# EasyEDA schematic EC01_esquematico_easyeda.json

## Sheets
1 01 Alimentacao e bateria
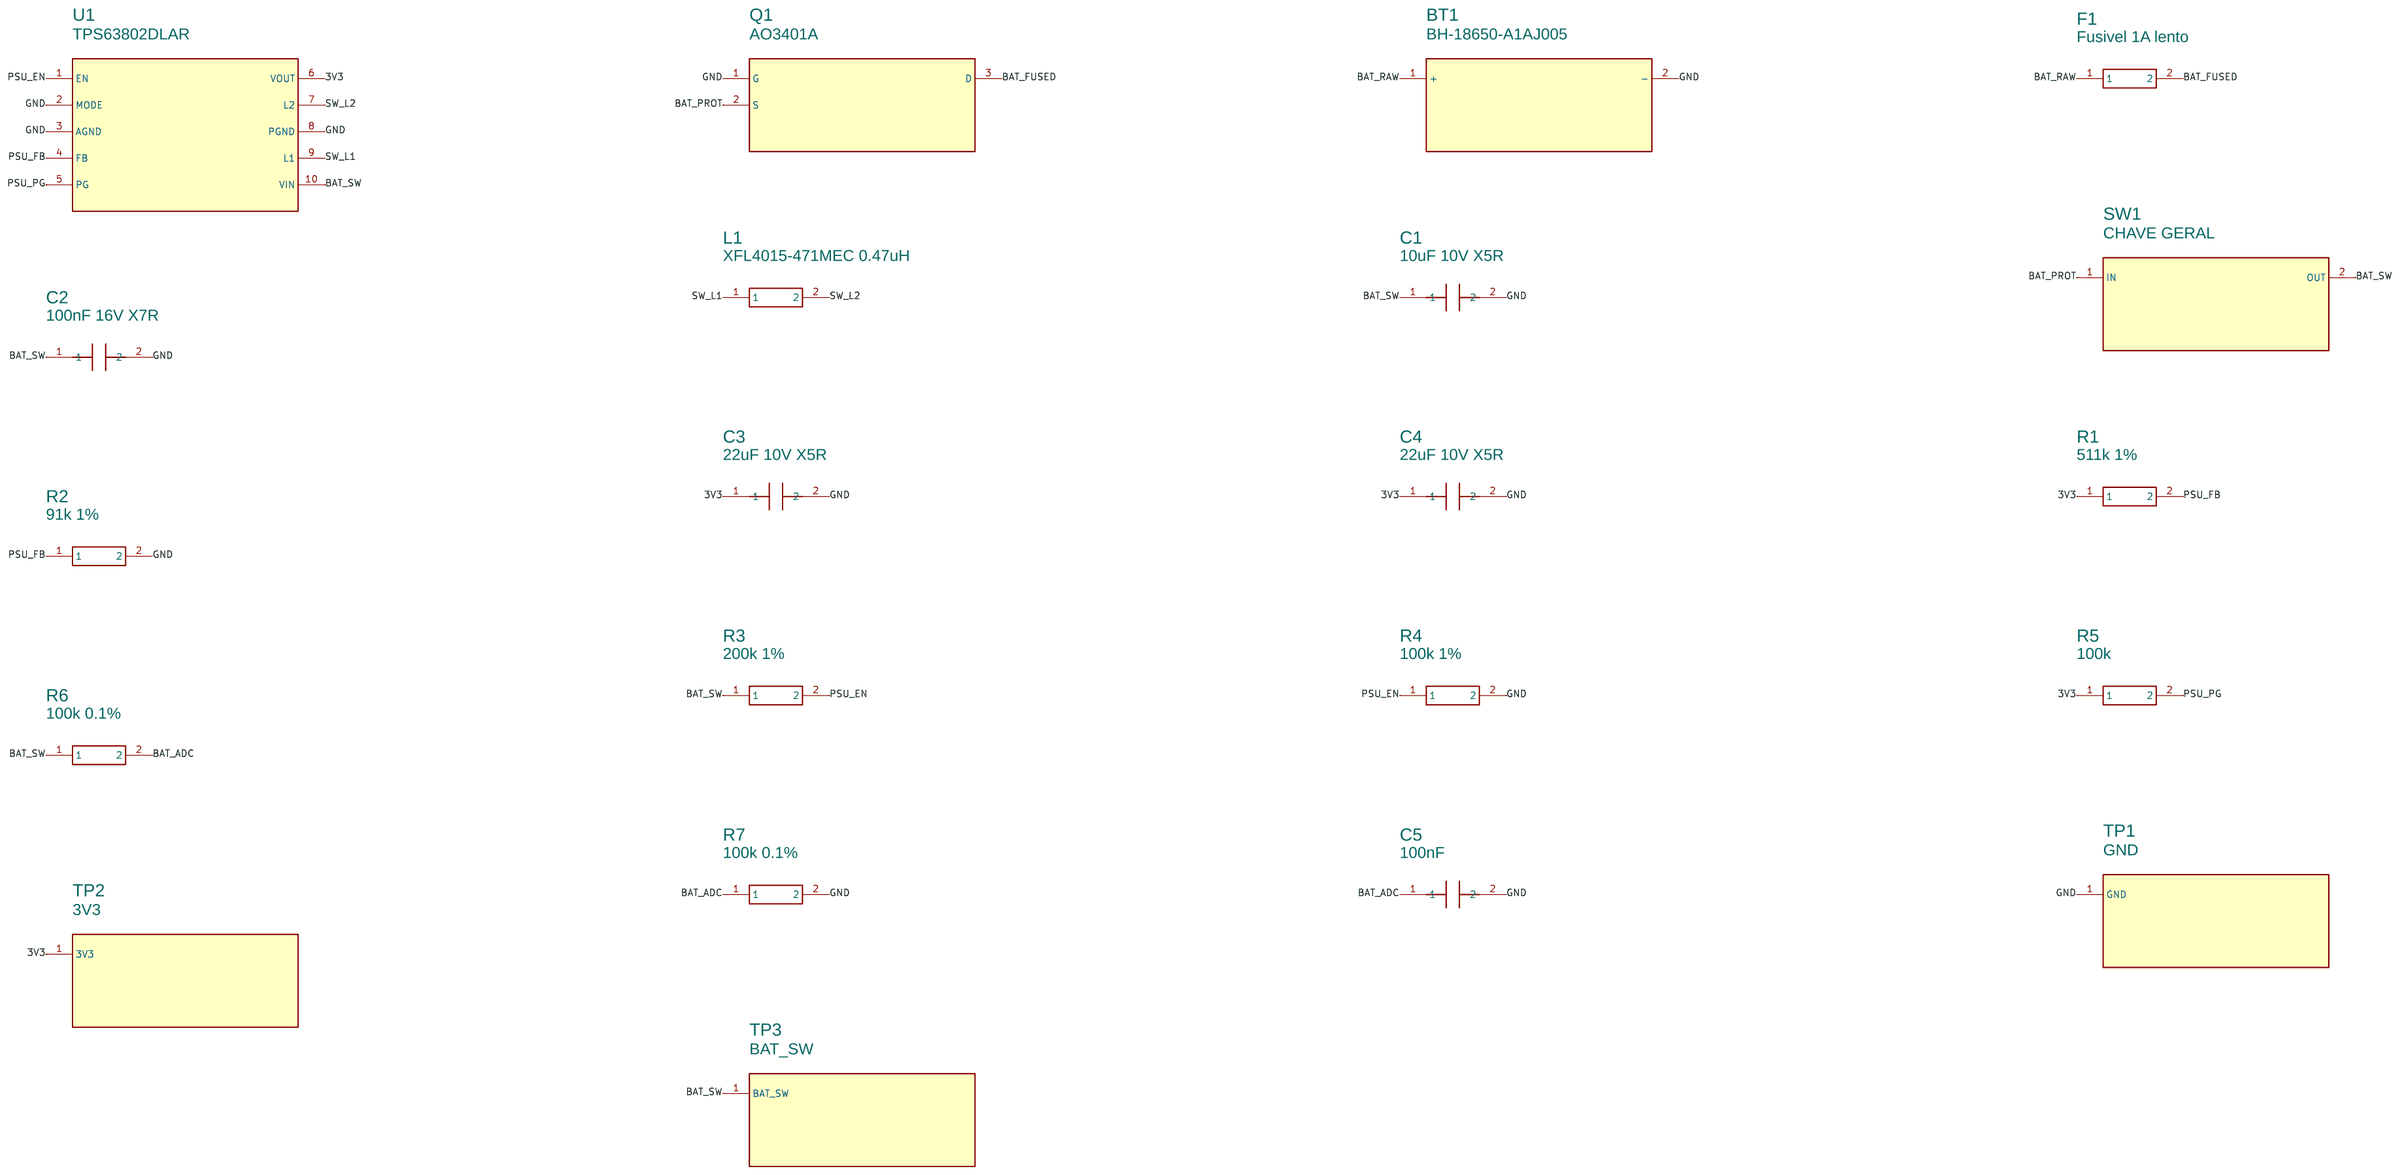
[diagram p0: 01 Alimentacao e bateria]
2 02 ESP32 e inicializacao
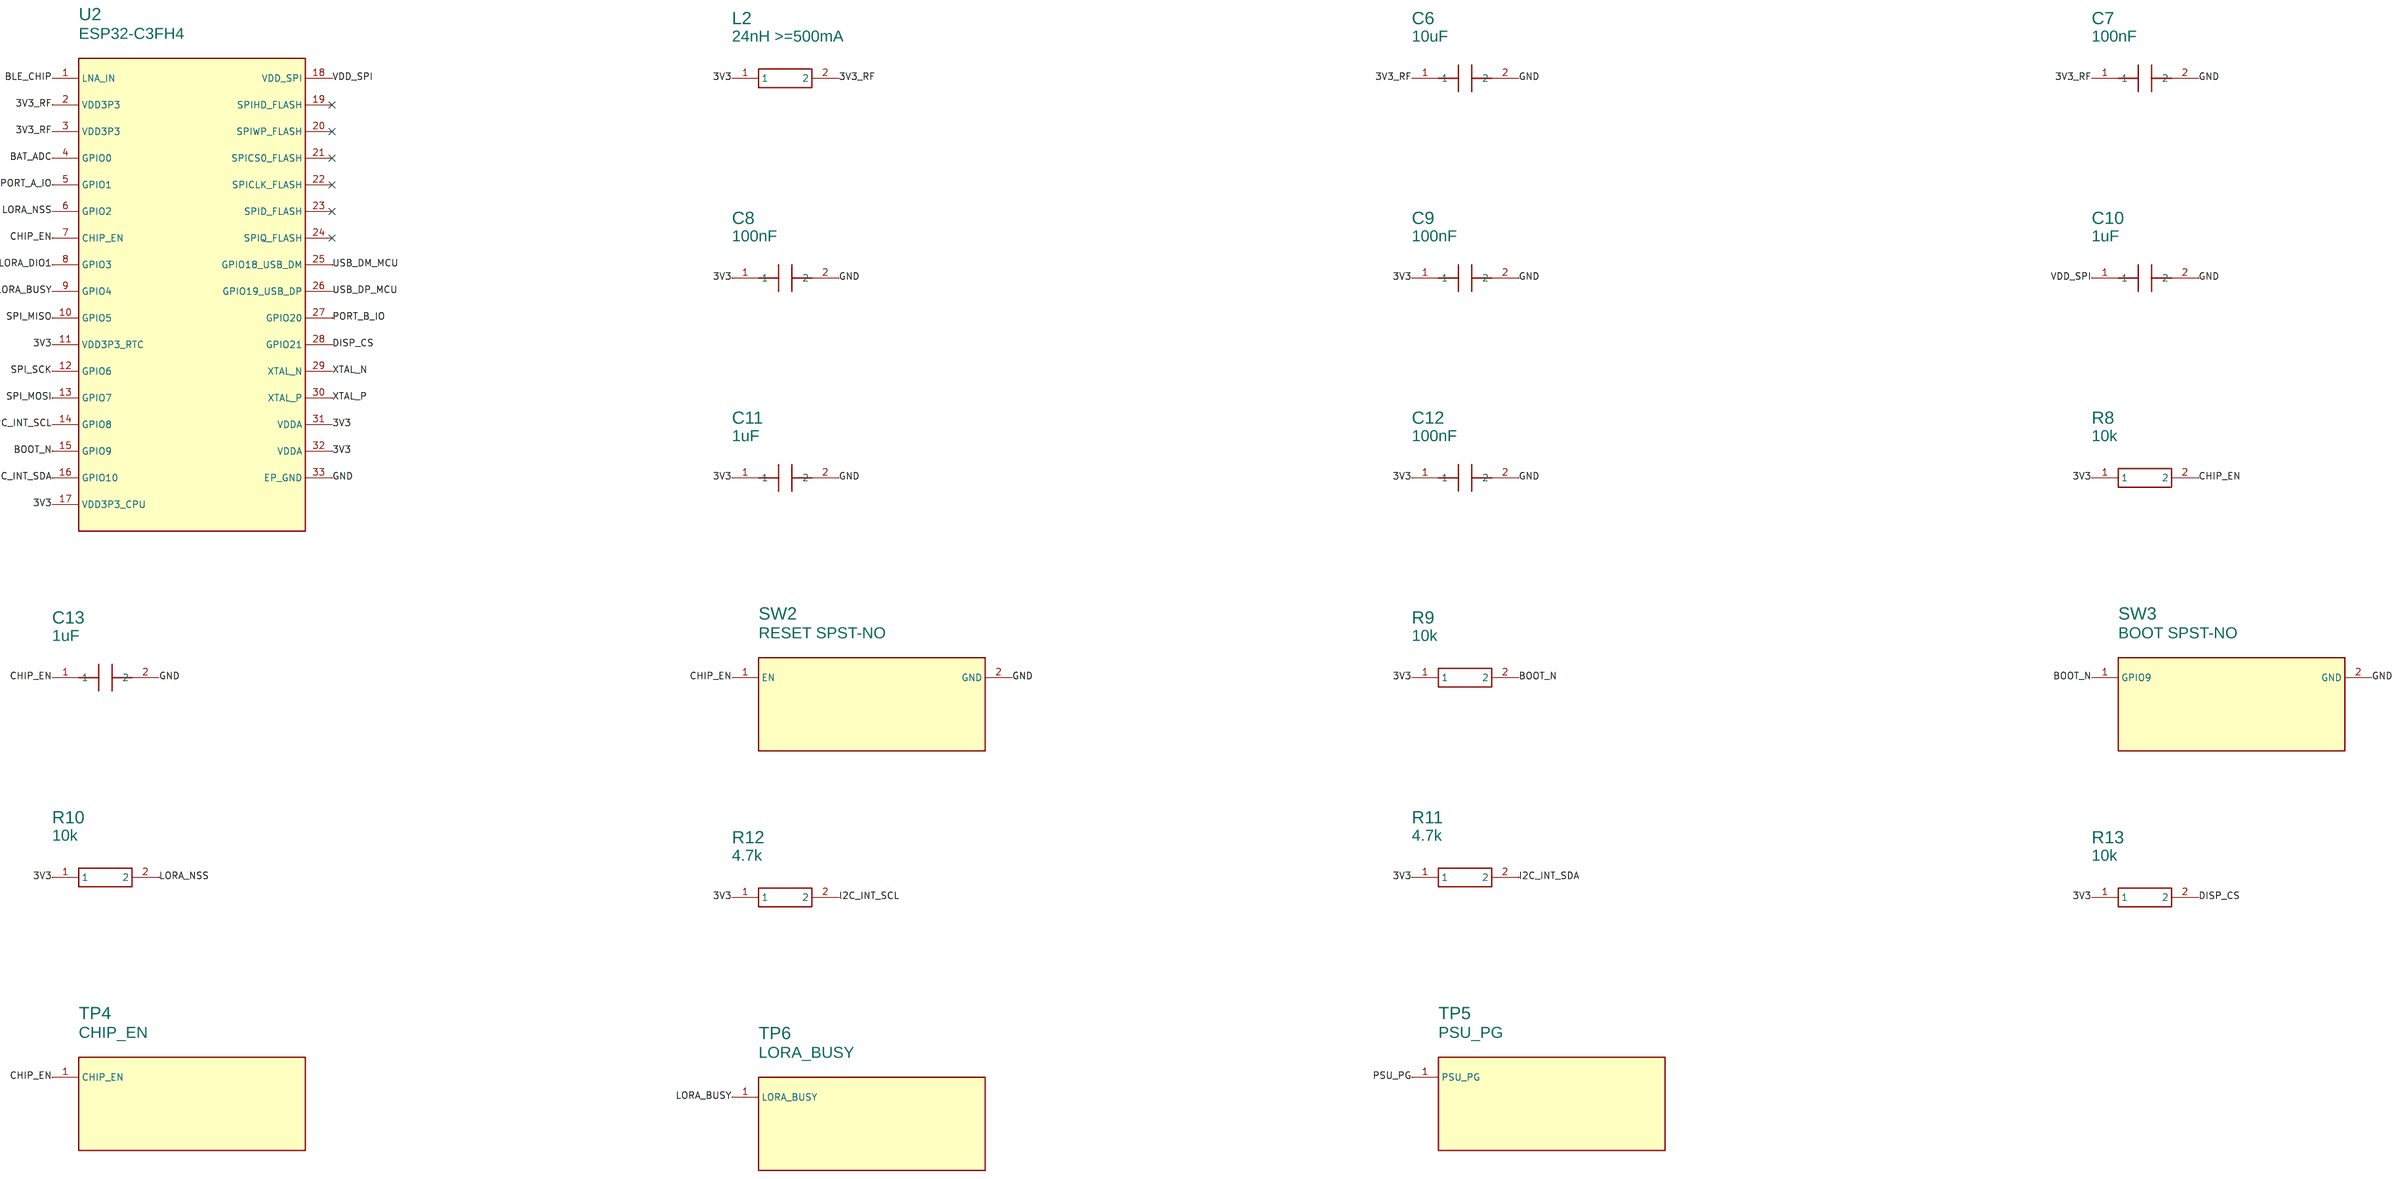
[diagram p1: 02 ESP32 e inicializacao]
3 03 BLE e cristal
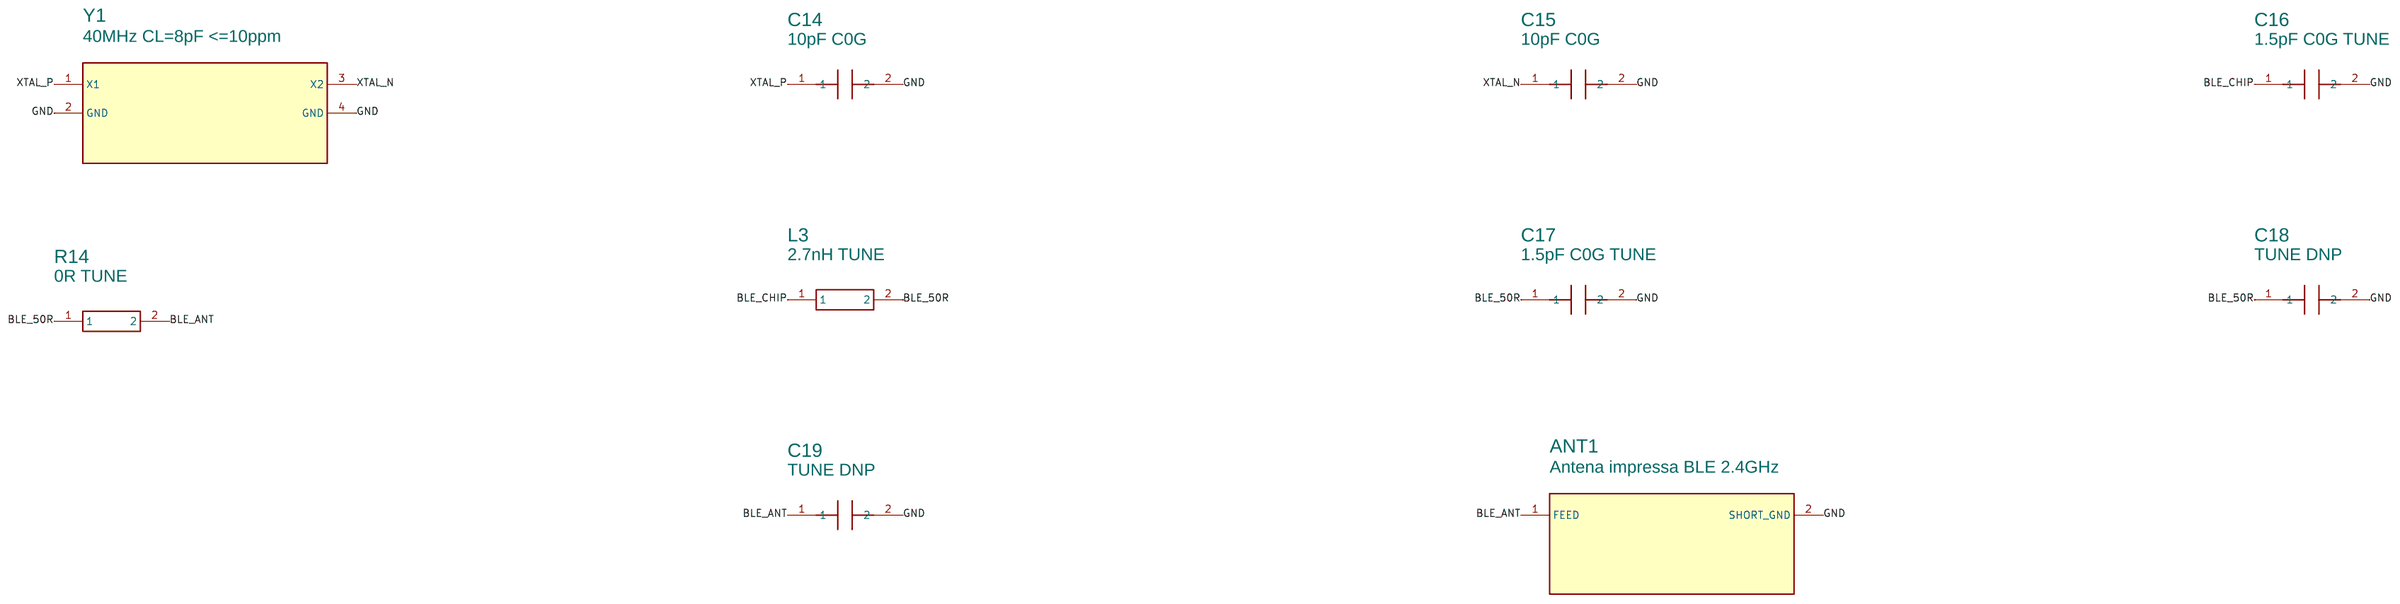
[diagram p2: 03 BLE e cristal]
4 04 Radio LoRa
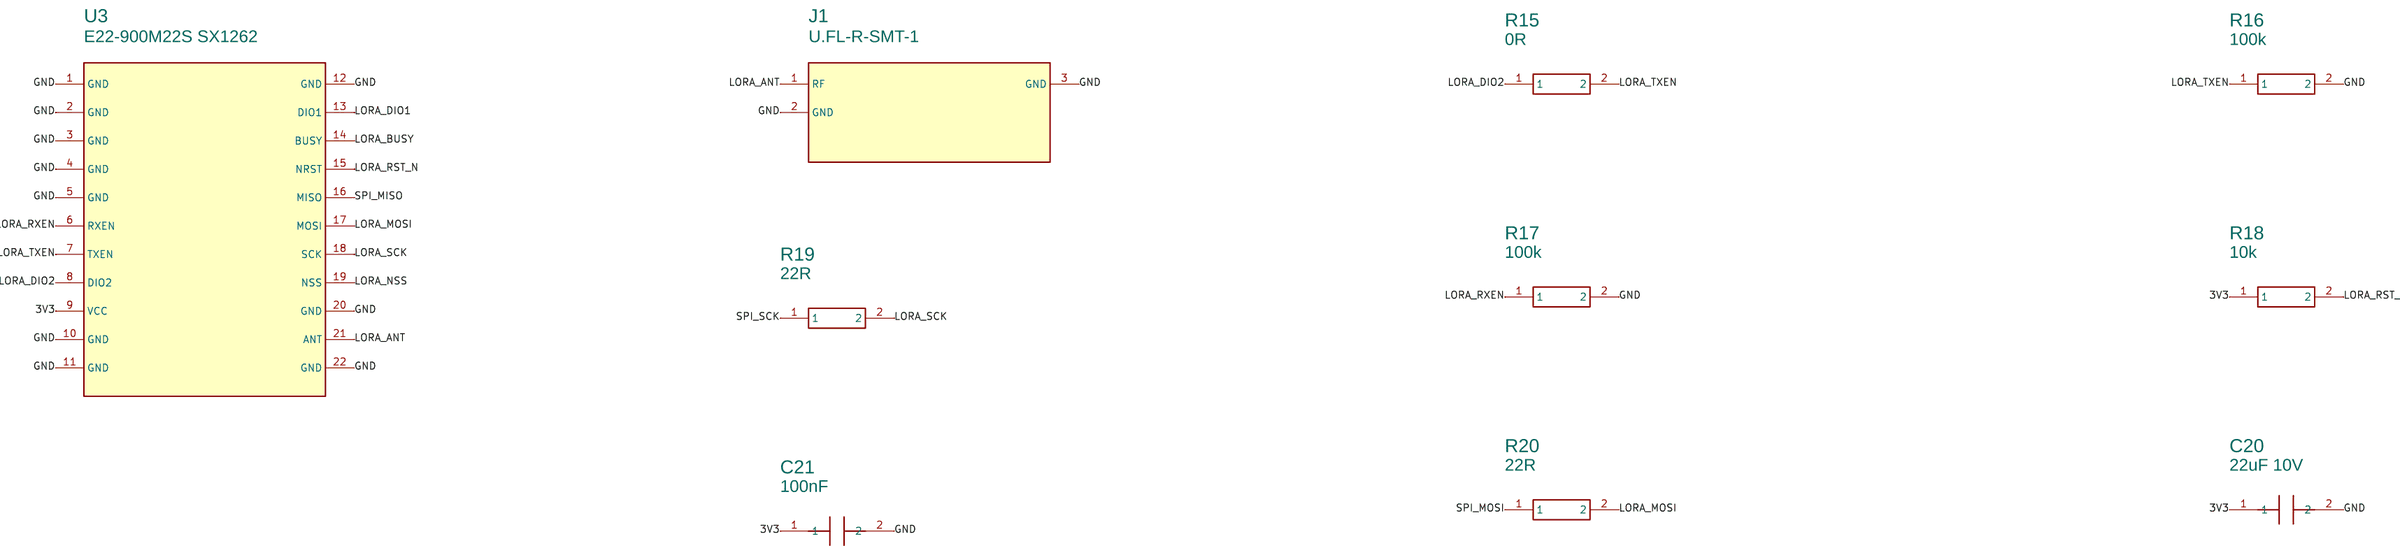
[diagram p3: 04 Radio LoRa]
5 05 Expansao e display
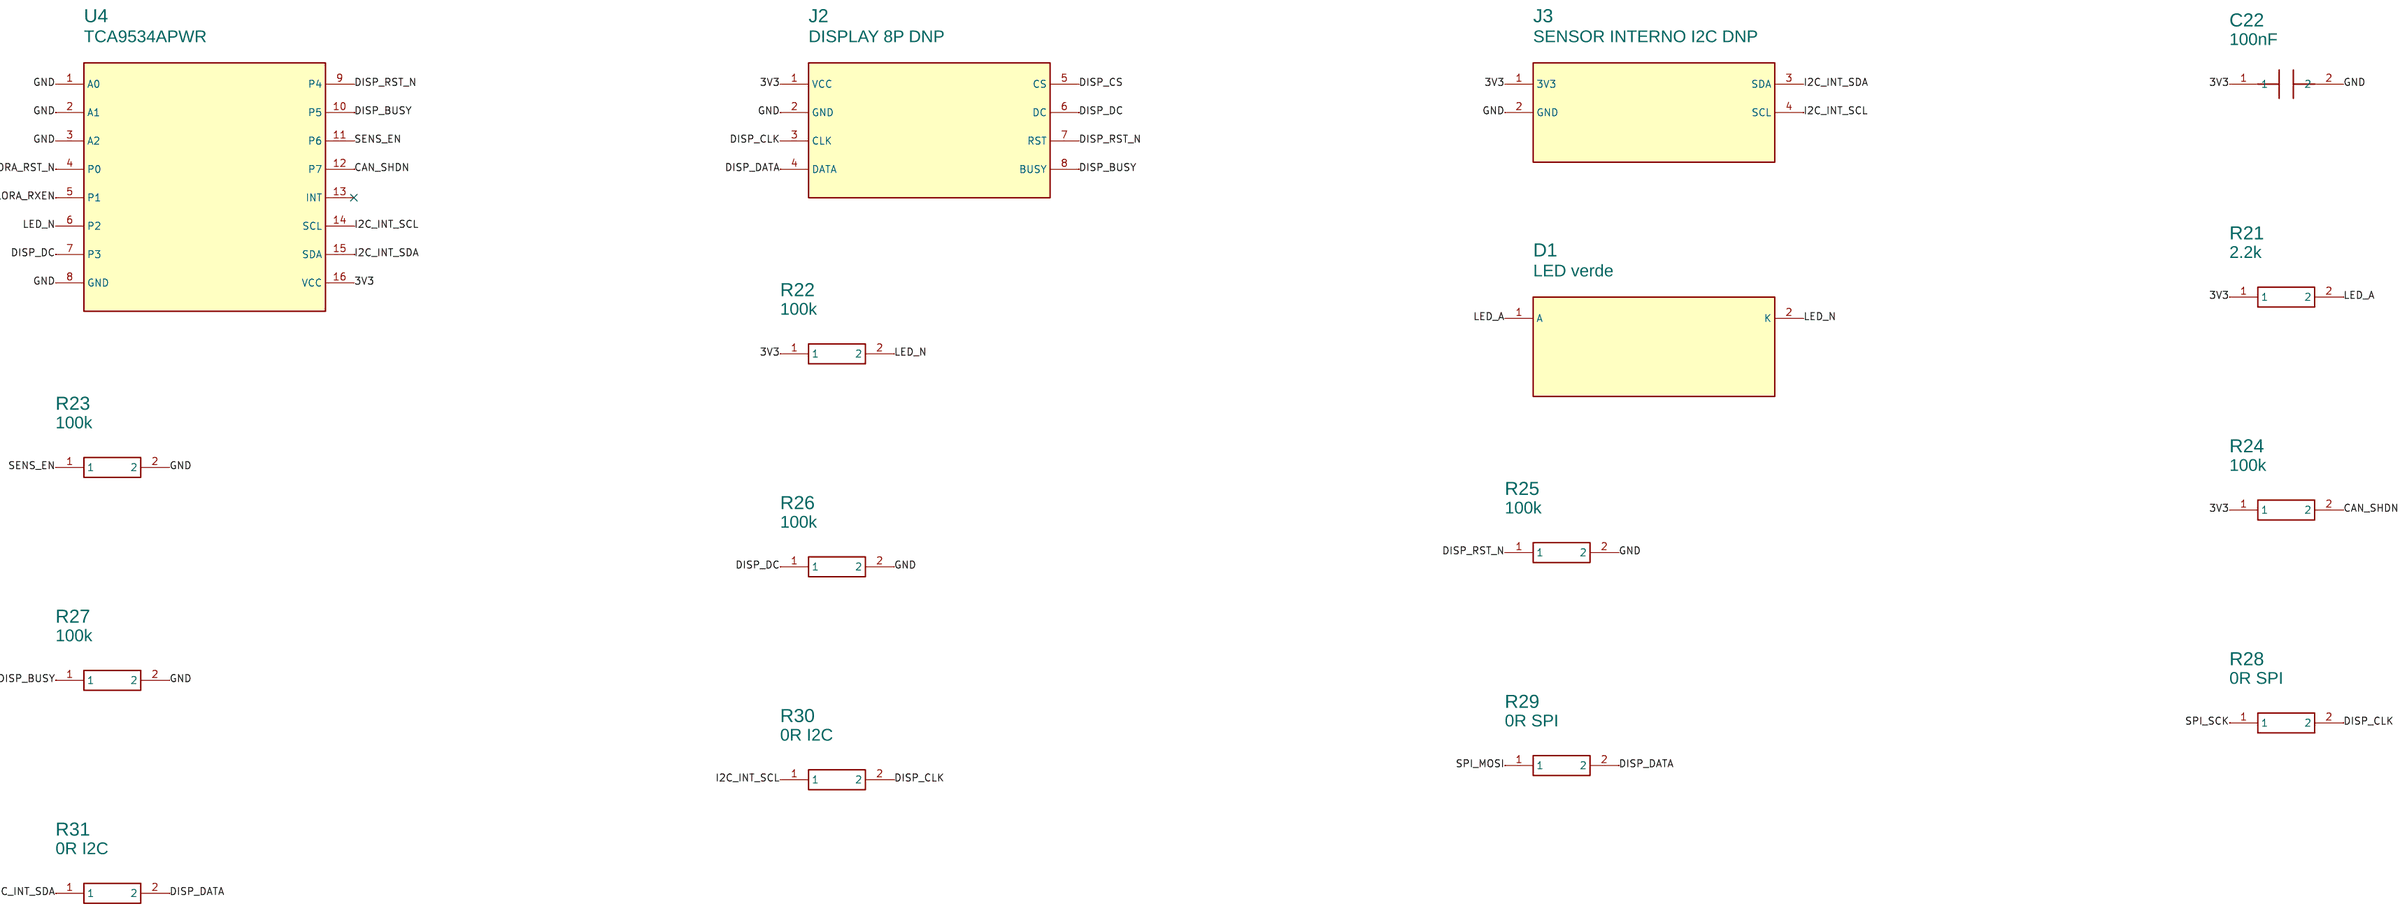
[diagram p4: 05 Expansao e display]
6 06 Sensores e CAN
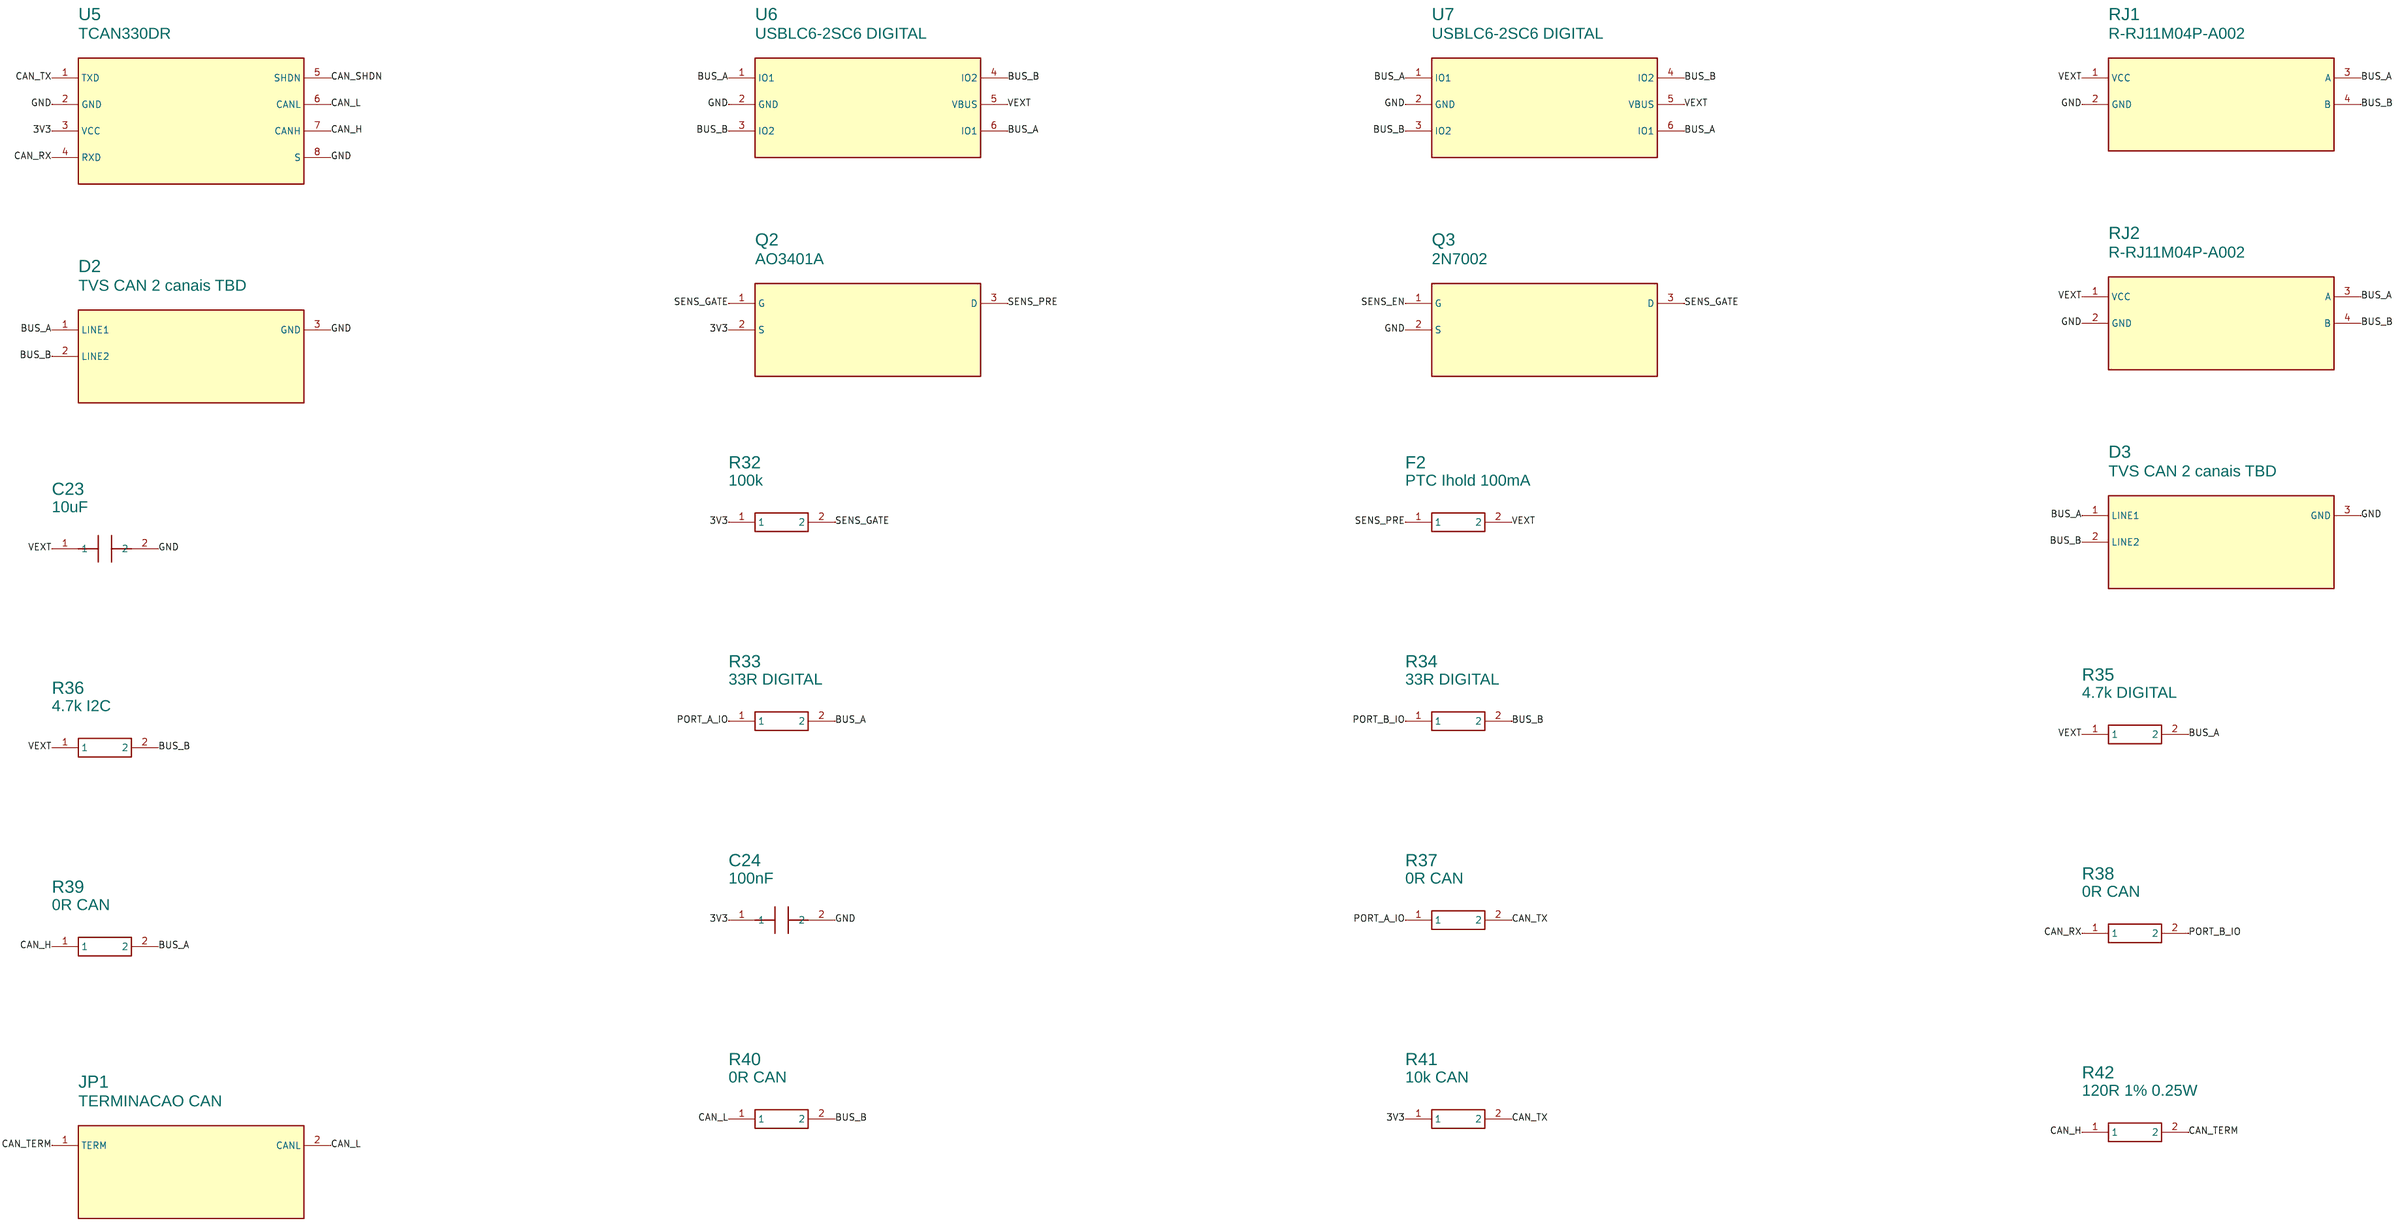
[diagram p5: 06 Sensores e CAN]
7 07 USB de servico
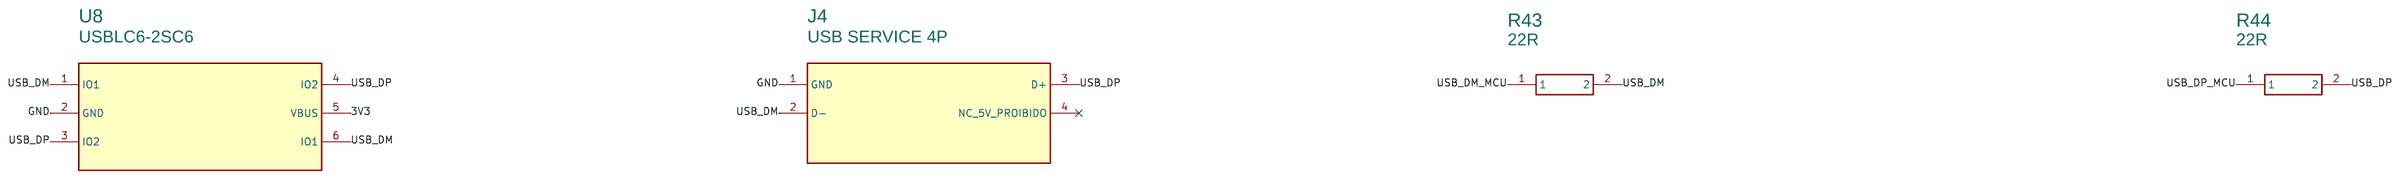
[diagram p6: 07 USB de servico]

## Parts
sheet 01 Alimentacao e bateria
BT1  BH-18650-A1AJ005  [PENDENTE_BH18650]
C1  10uF 10V X5R  [0805]
C2  100nF 16V X7R  [0603]
C3  22uF 10V X5R  [0805]
C4  22uF 10V X5R  [0805]
C5  100nF  [0603]
F1  Fusivel 1A lento  [1206]
L1  XFL4015-471MEC 0.47uH  [L4X4]
Q1  AO3401A  [SOT23]
R1  511k 1%  [0603]
R2  91k 1%  [0603]
R3  200k 1%  [0603]
R4  100k 1%  [0603]
R5  100k  [0603]
R6  100k 0.1%  [0603]
R7  100k 0.1%  [0603]
SW1  CHAVE GERAL  [HDR2]
TP1  GND  [TP]
TP2  3V3  [TP]
TP3  BAT_SW  [TP]
U1  TPS63802DLAR  [DLA10]
sheet 02 ESP32 e inicializacao
C6  10uF  [0603]
C7  100nF  [0603]
C8  100nF  [0603]
C9  100nF  [0603]
C10  1uF  [0603]
C11  1uF  [0603]
C12  100nF  [0603]
C13  1uF  [0603]
L2  24nH >=500mA  [0603]
R8  10k  [0603]
R9  10k  [0603]
R10  10k  [0603]
R11  4.7k  [0603]
R12  4.7k  [0603]
R13  10k  [0603]
SW2  RESET SPST-NO  [BOTAO_A_DEFINIR]
SW3  BOOT SPST-NO  [BOTAO_A_DEFINIR]
TP4  CHIP_EN  [TP]
TP5  PSU_PG  [TP]
TP6  LORA_BUSY  [TP]
U2  ESP32-C3FH4  [QFN32_5X5_EP3_7]
sheet 03 BLE e cristal
ANT1  Antena impressa BLE 2.4GHz  [PENDENTE_ANTENA]
C14  10pF C0G  [0402]
C15  10pF C0G  [0402]
C16  1.5pF C0G TUNE  [0201]
C17  1.5pF C0G TUNE  [0201]
C18  TUNE DNP  [0201]
C19  TUNE DNP  [0201]
L3  2.7nH TUNE  [0201]
R14  0R TUNE  [0201]
Y1  40MHz CL=8pF <=10ppm  [XTAL3225]
sheet 04 Radio LoRa
C20  22uF 10V  [0805]
C21  100nF  [0603]
J1  U.FL-R-SMT-1  [UFL]
R15  0R  [0603]
R16  100k  [0603]
R17  100k  [0603]
R18  10k  [0603]
R19  22R  [0603]
R20  22R  [0603]
U3  E22-900M22S SX1262  [E22_900M22S]
sheet 05 Expansao e display
C22  100nF  [0603]
D1  LED verde  [0603]
J2  DISPLAY 8P DNP  [HDR8]
J3  SENSOR INTERNO I2C DNP  [HDR4]
R21  2.2k  [0603]
R22  100k  [0603]
R23  100k  [0603]
R24  100k  [0603]
R25  100k  [0603]
R26  100k  [0603]
R27  100k  [0603]
R28  0R SPI  [0603]
R29  0R SPI  [0603]
R30  0R I2C  [0603]
R31  0R I2C  [0603]
U4  TCA9534APWR  [TSSOP16]
sheet 06 Sensores e CAN
C23  10uF  [0805]
C24  100nF  [0603]
D2  TVS CAN 2 canais TBD  [TVS_CAN_A_DEFINIR]
D3  TVS CAN 2 canais TBD  [TVS_CAN_A_DEFINIR]
F2  PTC Ihold 100mA  [1206]
JP1  TERMINACAO CAN  [HDR2]
Q2  AO3401A  [SOT23]
Q3  2N7002  [SOT23]
R32  100k  [0603]
R33  33R DIGITAL  [0603]
R34  33R DIGITAL  [0603]
R35  4.7k DIGITAL  [0603]
R36  4.7k I2C  [0603]
R37  0R CAN  [0603]
R38  0R CAN  [0603]
R39  0R CAN  [0603]
R40  0R CAN  [0603]
R41  10k CAN  [0603]
R42  120R 1% 0.25W  [1206]
RJ1  R-RJ11M04P-A002  [PENDENTE_RJ11]
RJ2  R-RJ11M04P-A002  [PENDENTE_RJ11]
U5  TCAN330DR  [SOIC8]
U6  USBLC6-2SC6 DIGITAL  [SOT23_6]
U7  USBLC6-2SC6 DIGITAL  [SOT23_6]
sheet 07 USB de servico
J4  USB SERVICE 4P  [HDR4]
R43  22R  [0603]
R44  22R  [0603]
U8  USBLC6-2SC6  [SOT23_6]

## Library data of the parts
ANT1 BT1 C1-C17 C20-C23 D1 F1 F2 J1 J4 L1-L3 Q1-Q3 R1-R27 R32-R35 R43 R44 RJ1 RJ2 SW1-SW3 TP1-TP6 U1-U4 U6-U8 Y1 = -: BOM: SIM
C18 C19 C24 D2 D3 J2 J3 JP1 R28-R31 R36-R42 U5 = -: BOM: NAO

## Nets
3V3: C3.1 C4.1 C8.1 C9.1 C11.1 C12.1 C20.1 C21.1 C22.1 C24.1 J2.1(VCC) J3.1(3V3) L2.1 Q2.2(S) R1.1 R5.1 R8.1 R9.1 R10.1 R11.1 R12.1 R13.1 R18.1 R21.1 R22.1 R24.1 R32.1 R41.1 TP2.1(3V3) U1.6(VOUT) U2.11(VDD3P3_RTC) U2.17(VDD3P3_CPU) U2.31(VDDA) U2.32(VDDA) U3.9(VCC) U4.16(VCC) U5.3(VCC) U8.5(VBUS)
3V3_RF: C6.1 C7.1 L2.2 U2.2(VDD3P3) U2.3(VDD3P3)
GND: ANT1.2(SHORT_GND) BT1.2(-) C1.2 C2.2 C3.2 C4.2 C5.2 C6.2 C7.2 C8.2 C9.2 C10.2 C11.2 C12.2 C13.2 C14.2 C15.2 C16.2 C17.2 C18.2 C19.2 C20.2 C21.2 C22.2 C23.2 C24.2 D2.3(GND) D3.3(GND) J1.2(GND) J1.3(GND) J2.2(GND) J3.2(GND) J4.1(GND) Q1.1(G) Q3.2(S) R2.2 R4.2 R7.2 R16.2 R17.2 R23.2 R25.2 R26.2 R27.2 RJ1.2(GND) RJ2.2(GND) SW2.2(GND) SW3.2(GND) TP1.1(GND) U1.2(MODE) U1.3(AGND) U1.8(PGND) U2.33(EP_GND) U3.1(GND) U3.2(GND) U3.3(GND) U3.4(GND) U3.5(GND) U3.10(GND) U3.11(GND) U3.12(GND) U3.20(GND) U3.22(GND) U4.1(A0) U4.2(A1) U4.3(A2) U4.8(GND) U5.2(GND) U5.8(S) U6.2(GND) U7.2(GND) U8.2(GND) Y1.2(GND) Y1.4(GND)
VDD_SPI: C10.1 U2.18(VDD_SPI)
BAT_ADC: C5.1 R6.2 R7.1 U2.4(GPIO0)
BAT_FUSED: F1.2 Q1.3(D)
BAT_PROT: Q1.2(S) SW1.1(IN)
BAT_RAW: BT1.1(+) F1.1
BAT_SW: C1.1 C2.1 R3.1 R6.1 SW1.2(OUT) TP3.1(BAT_SW) U1.10(VIN)
BLE_50R: C17.1 C18.1 L3.2 R14.1
BLE_ANT: ANT1.1(FEED) C19.1 R14.2
BLE_CHIP: C16.1 L3.1 U2.1(LNA_IN)
BOOT_N: R9.2 SW3.1(GPIO9) U2.15(GPIO9)
BUS_A: D2.1(LINE1) D3.1(LINE1) R33.2 R35.2 R39.2 RJ1.3(A) RJ2.3(A) U6.1(IO1) U6.6(IO1) U7.1(IO1) U7.6(IO1)
BUS_B: D2.2(LINE2) D3.2(LINE2) R34.2 R36.2 R40.2 RJ1.4(B) RJ2.4(B) U6.3(IO2) U6.4(IO2) U7.3(IO2) U7.4(IO2)
CAN_H: R39.1 R42.1 U5.7(CANH)
CAN_L: JP1.2(CANL) R40.1 U5.6(CANL)
CAN_RX: R38.1 U5.4(RXD)
CAN_SHDN: R24.2 U4.12(P7) U5.5(SHDN)
CAN_TERM: JP1.1(TERM) R42.2
CAN_TX: R37.2 R41.2 U5.1(TXD)
CHIP_EN: C13.1 R8.2 SW2.1(EN) TP4.1(CHIP_EN) U2.7(CHIP_EN)
DISP_BUSY: J2.8(BUSY) R27.1 U4.10(P5)
DISP_CLK: J2.3(CLK) R28.2 R30.2
DISP_CS: J2.5(CS) R13.2 U2.28(GPIO21)
DISP_DATA: J2.4(DATA) R29.2 R31.2
DISP_DC: J2.6(DC) R26.1 U4.7(P3)
DISP_RST_N: J2.7(RST) R25.1 U4.9(P4)
I2C_INT_SCL: J3.4(SCL) R12.2 R30.1 U2.14(GPIO8) U4.14(SCL)
I2C_INT_SDA: J3.3(SDA) R11.2 R31.1 U2.16(GPIO10) U4.15(SDA)
LED_A: D1.1(A) R21.2
LED_N: D1.2(K) R22.2 U4.6(P2)
LORA_ANT: J1.1(RF) U3.21(ANT)
LORA_BUSY: TP6.1(LORA_BUSY) U2.9(GPIO4) U3.14(BUSY)
LORA_DIO1: U2.8(GPIO3) U3.13(DIO1)
LORA_DIO2: R15.1 U3.8(DIO2)
LORA_MOSI: R20.2 U3.17(MOSI)
LORA_NSS: R10.2 U2.6(GPIO2) U3.19(NSS)
LORA_RST_N: R18.2 U3.15(NRST) U4.4(P0)
LORA_RXEN: R17.1 U3.6(RXEN) U4.5(P1)
LORA_SCK: R19.2 U3.18(SCK)
LORA_TXEN: R15.2 R16.1 U3.7(TXEN)
PORT_A_IO: R33.1 R37.1 U2.5(GPIO1)
PORT_B_IO: R34.1 R38.2 U2.27(GPIO20)
PSU_EN: R3.2 R4.1 U1.1(EN)
PSU_FB: R1.2 R2.1 U1.4(FB)
PSU_PG: R5.2 TP5.1(PSU_PG) U1.5(PG)
SENS_EN: Q3.1(G) R23.1 U4.11(P6)
SENS_GATE: Q2.1(G) Q3.3(D) R32.2
SENS_PRE: F2.1 Q2.3(D)
SPI_MISO: U2.10(GPIO5) U3.16(MISO)
SPI_MOSI: R20.1 R29.1 U2.13(GPIO7)
SPI_SCK: R19.1 R28.1 U2.12(GPIO6)
SW_L1: L1.1 U1.9(L1)
SW_L2: L1.2 U1.7(L2)
USB_DM: J4.2(D-) R43.2 U8.1(IO1) U8.6(IO1)
USB_DM_MCU: R43.1 U2.25(GPIO18_USB_DM)
USB_DP: J4.3(D+) R44.2 U8.3(IO2) U8.4(IO2)
USB_DP_MCU: R44.1 U2.26(GPIO19_USB_DP)
VEXT: C23.1 F2.2 R35.1 R36.1 RJ1.1(VCC) RJ2.1(VCC) U6.5(VBUS) U7.5(VBUS)
XTAL_N: C15.1 U2.29(XTAL_N) Y1.3(X2)
XTAL_P: C14.1 U2.30(XTAL_P) Y1.1(X1)

Not connected (* = marked no-connect by the designer): J4 4(NC_5V_PROIBIDO)*; U2 19(SPIHD_FLASH)* 20(SPIWP_FLASH)* 21(SPICS0_FLASH)* 22(SPICLK_FLASH)* 23(SPID_FLASH)* 24(SPIQ_FLASH)*; U4 13(INT)*

## Notes on the sheets
sheet 1
- 01 Alimentacao e bateria
- EC01 REV0.1 - PROJETO PRELIMINAR - nao liberar fabricacao
sheet 2
- 02 ESP32 e inicializacao
- EC01 REV0.1 - PROJETO PRELIMINAR - nao liberar fabricacao
sheet 3
- 03 BLE e cristal
- EC01 REV0.1 - PROJETO PRELIMINAR - nao liberar fabricacao
sheet 4
- 04 Radio LoRa
- EC01 REV0.1 - PROJETO PRELIMINAR - nao liberar fabricacao
sheet 5
- 05 Expansao e display
- EC01 REV0.1 - PROJETO PRELIMINAR - nao liberar fabricacao
sheet 6
- 06 Sensores e CAN
- EC01 REV0.1 - PROJETO PRELIMINAR - nao liberar fabricacao
sheet 7
- 07 USB de servico
- EC01 REV0.1 - PROJETO PRELIMINAR - nao liberar fabricacao
